# Altium schematic sheet 0131_EC - FLASH.SchDoc
size A3
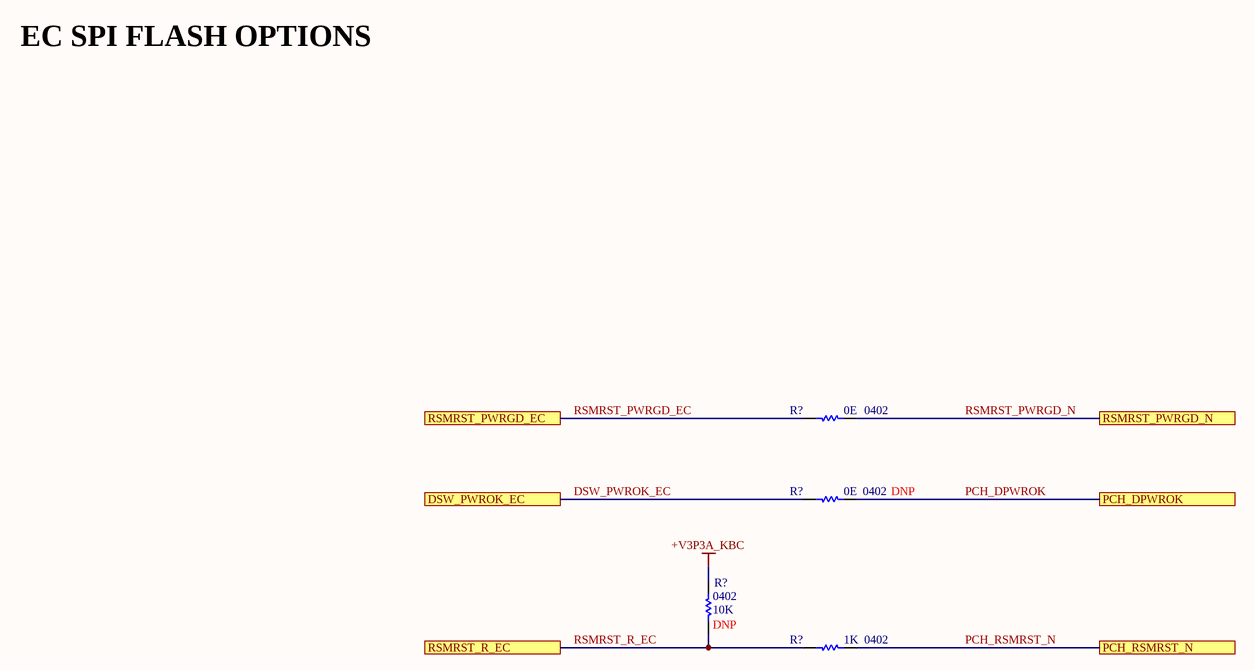
[diagram p0: 0131_EC - FLASH.SchDoc]

## Parts
(Parts that share a designator on the sheet are numbered #1, #2 ... from top to bottom, then left to right.)
R?#1  value 0E  Case/Package: 0402  [RESC0402]  (hidden comment: Res)
R?#2  value 0E  Case/Package: 0402  [RESC0402]  (hidden comment: Res)
R?#3  value 10K  Case/Package: 0402  [RESC0402]  (hidden comment: Res)
R?#4  value 1K  Case/Package: 0402  [RESC0402]  (hidden comment: Res)

## Ports
DSW_PWROK_EC, PCH_DPWROK, PCH_RSMRST_N, RSMRST_PWRGD_EC, RSMRST_PWRGD_N, RSMRST_R_EC

## Nets
+V3P3A_KBC: R?#3.2
DSW_PWROK_EC: R?#2.1 ; port DSW_PWROK_EC
PCH_DPWROK: R?#2.2 ; port PCH_DPWROK
PCH_RSMRST_N: R?#4.2 ; port PCH_RSMRST_N
RSMRST_PWRGD_EC: R?#1.1 ; port RSMRST_PWRGD_EC
RSMRST_PWRGD_N: R?#1.2 ; port RSMRST_PWRGD_N
RSMRST_R_EC: R?#3.1 R?#4.1 ; port RSMRST_R_EC

## Notes on the sheet
- EC SPI FLASH OPTIONS

## Library data of the parts
R?#1 R?#2 = Res: Thick Film Resistor -  0ohm, 1%, 0402
  R?#2: DNP: DNP
R?#3 = Res: Thick Film Resistor -  10Kohm, 1%, 0402; DNP: DNP
R?#4 = Res: Thick Film Resistor -  1Kohm, 1%, 0402